# EAGLE design filter (EAGLE 7.1.0)
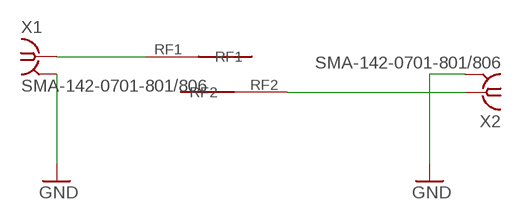
[diagram p0: schematic, sheet 1]

## Parts
U$1  FILTER  [RF]
X1  SMA-142-0701-801/806  [J502-ND-142-0701-801/806]
X2  SMA-142-0701-801/806  [J502-ND-142-0701-801/806]

## Nets
GND: X1.G@1 X1.G@2 X1.G@3 X1.G@4 X2.G@1 X2.G@2 X2.G@3 X2.G@4
SIG1: U$1.RF1 X1.1
SIG2: U$1.RF2 X2.1

## Library data of the parts
U$1 = rf:FILTER
X1 X2 = con-coax:SMA-: SMA 50 Ohm End Launch Jack Receptacle - Round Contact Johnson Components Source: www.johnsoncomponents.com .. J502-ND.pdf; MF: JOHNSON COMPONENTS; MPN: 142-0701-801; OC_FARNELL: 1608592; OC_NEWARK: 90F2624

## Board
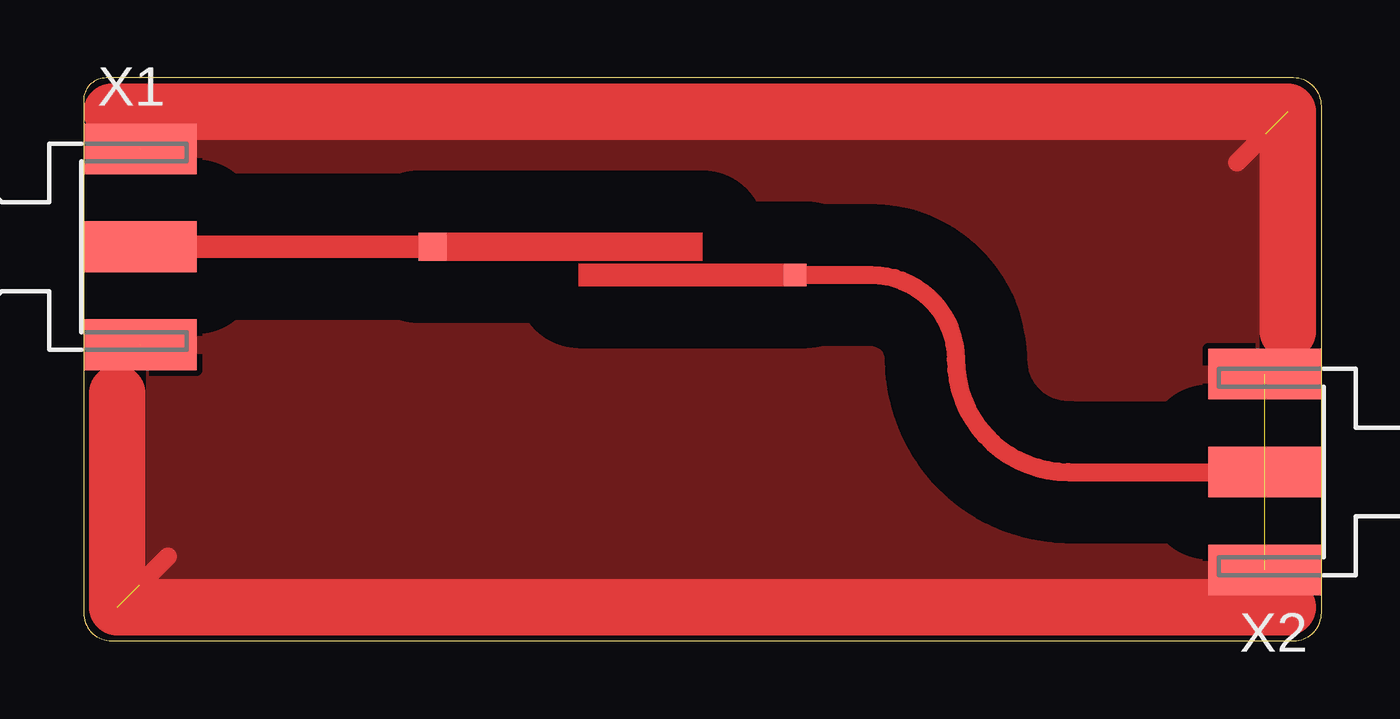
[diagram p1: board, top side]
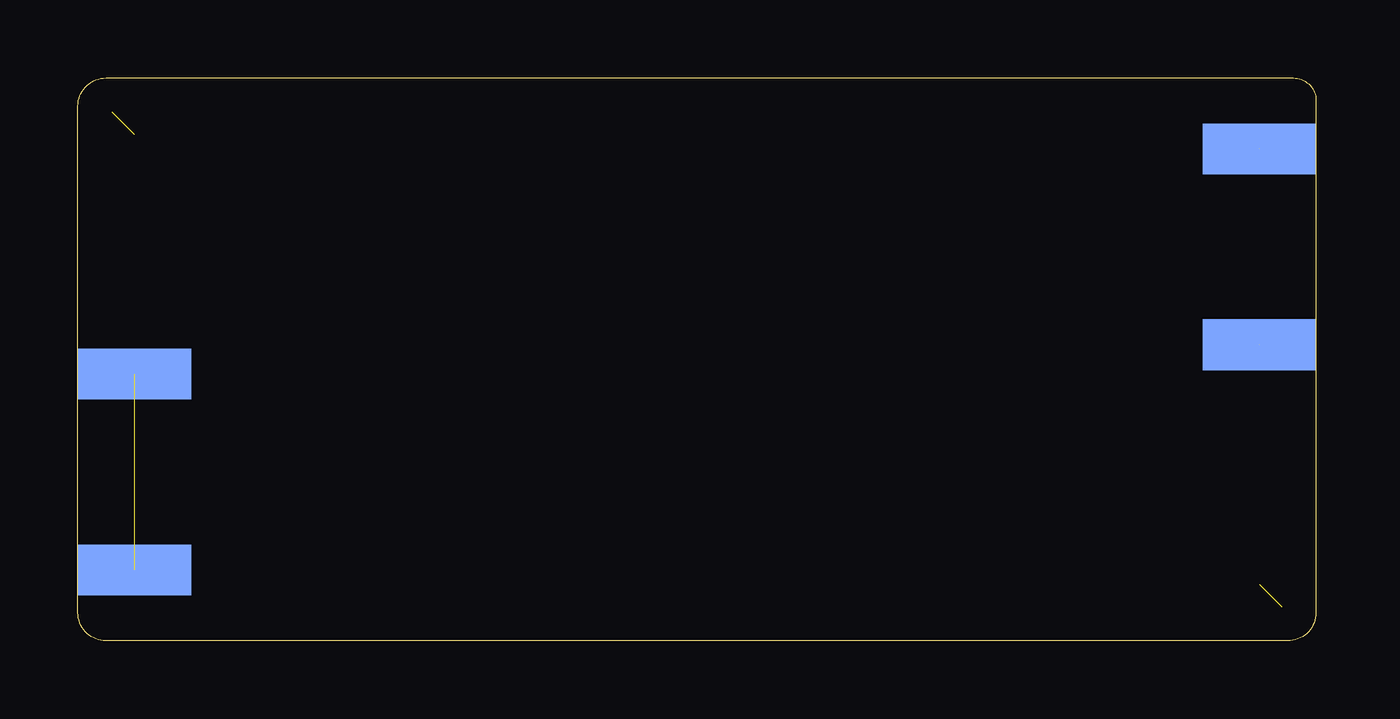
[diagram p2: board, bottom side, seen from below]

Size 55.88 x 25.4 mm. Coordinates in mm from the lower left corner, seen from the top.
Outline: 0,24.37 0,1.27 arc90 1.27,0 54.61,0 arc90 55.88,1.27 55.88,24.13 arc90 54.61,25.4 1.03,25.4 arc90 0,24.37
Copper layers (1*16): Top 0.035mm / dielectric 1.5mm / Bottom 0.035mm
Design rules "default": minimum track width 10mil, minimum drill 24mil, track to track 8mil, track to pad 8mil, pad to pad 8mil, via to via 8mil, smd to smd 8mil, copper to edge 40mil, drill to drill 8mil, minimum pad ring 10mil, minimum via ring 8mil, stop-mask expansion 4mil, vias tented up to drill 0mil, thermal gap 10mil

### Footprints (pad centres in the part's own frame; a part is rotated, then mirrored left to right if it is on the bottom)
RF = smd 1.27 x 1.27: RF1 -8.382,0.635 | smd 1.016 x 1.016: RF2 8.001,-0.635
J502-ND-142-0701-801/806 = smd 5.08 x 2.286: 1 2.565,0; G@1 2.565,4.42; G@2 2.565,-4.42 | smd 5.08 x 2.286 bottom: G@3 2.565,4.42; G@4 2.565,-4.42

### Placement (x,y rotation side)
U$1  24.13,17.14 0 top
X1  0,17.78 0 top
X2  55.88,7.62 180 top

### Tracks (layer width: path | path; a pad name or v marks a point on that pad's centre or on a via)
GND  (7 unrouted)
  Top 0.813: 52.07,21.59 53.34,22.86 | 2.54,2.54 3.81,3.81
  Top 2.54: 1.27,23.88 54.36,23.88 54.36,13.97 | 1.52,11.18 1.52,1.52 54.36,1.52
  pour Top (isolate 2.794): 0,0 0,25.4 55.88,25.4 55.88,0
SIG1
  Top 1.016: X1.1 U$1.RF1
SIG2
  Top 0.813: U$1.RF2 35.56,16.51 arc-90 39.37,12.7 arc90 44.45,7.62 X2.1